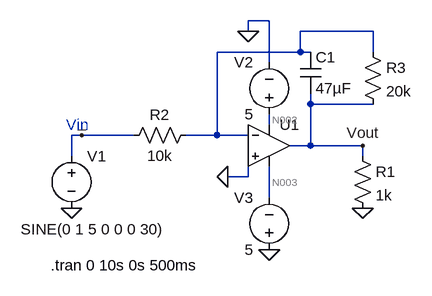
[diagram p0: schematic Draft3.asc]
Draft3.asc, the LTspice schematic file:
Version 4
SHEET 1 880 680
WIRE 144 16 112 16
WIRE 112 32 112 16
WIRE 304 32 192 32
WIRE 192 64 192 32
WIRE 192 64 64 64
WIRE 208 64 192 64
WIRE 304 64 304 32
WIRE 144 80 144 16
WIRE 208 144 208 128
WIRE 304 144 208 144
WIRE 144 176 144 160
WIRE -144 192 -160 192
WIRE -64 192 -144 192
WIRE 64 192 64 64
WIRE 64 192 16 192
WIRE 112 192 64 192
WIRE 208 208 208 144
WIRE 208 208 176 208
WIRE 288 208 208 208
WIRE -160 224 -160 192
WIRE 288 224 288 208
WIRE 112 256 112 224
WIRE 112 256 80 256
WIRE 144 288 144 240
FLAG 288 304 0
FLAG 80 256 0
FLAG 144 368 0
FLAG 112 32 0
FLAG -160 304 0
FLAG -144 192 _
FLAG 288 208 Vout
SYMBOL cap 192 64 R0
SYMATTR InstName C1
SYMATTR Value 47µF
SYMBOL Opamps\\UniversalOpamp2 144 208 R0
SYMATTR InstName U1
SYMBOL res 272 208 R0
SYMATTR InstName R1
SYMATTR Value 1k
SYMBOL res -80 208 R270
WINDOW 0 32 56 VTop 2
WINDOW 3 0 56 VBottom 2
SYMATTR InstName R2
SYMATTR Value 10k
SYMBOL voltage -160 208 R0
WINDOW 3 -78 129 Left 2
WINDOW 123 0 0 Left 0
WINDOW 39 0 0 Left 0
SYMATTR Value SINE(0 1 5 0 0 0 30)
SYMATTR InstName V1
SYMBOL voltage 144 176 R180
WINDOW 0 24 96 Left 2
WINDOW 3 24 16 Left 2
WINDOW 123 0 0 Left 0
WINDOW 39 0 0 Left 0
SYMATTR InstName V2
SYMATTR Value 5
SYMBOL voltage 144 384 R180
WINDOW 0 24 96 Left 2
WINDOW 3 24 16 Left 2
WINDOW 123 0 0 Left 0
WINDOW 39 0 0 Left 0
SYMATTR InstName V3
SYMATTR Value 5
SYMBOL res 288 48 R0
SYMATTR InstName R3
SYMATTR Value 20k
TEXT -192 392 Left 2 !.tran 0 10s 0s 500ms
TEXT -168 176 Left 2 ;Vin

The netlist it stands for:
* Draft3.asc
C1 N001 Vout 47µF
XU1 0 N001 N002 N003 Vout level.2 Avol=1Meg GBW=10Meg Slew=10Meg ilimit=25m rail=0 Vos=0 phimargin=45 en=0 enk=0 in=0 ink=0 Rin=500Meg  ; pins IN+ IN- V+ V- OUT
R1 Vout 0 1k
R2 _ N001 10k
V1 _ 0 SINE(0 1 5 0 0 0 30)
V2 N002 0 5
V3 0 N003 5
R3 N001 Vout 20k
.tran 0 10s 0s 500ms
* Vin
.lib UniversalOpamps2.sub
.backanno
.end

* Results of the author's LTspice run, read from the files saved beside the schematic
* Operating Point, zero values left out:
*   V(n002) = 5 V
*   V(n003) = -5 V
*   I(V3) = -500 µA
*   I(V2) = -500 µA
*   Ix(u1:3) = 500 µA
*   Ix(u1:4) = -500 µA
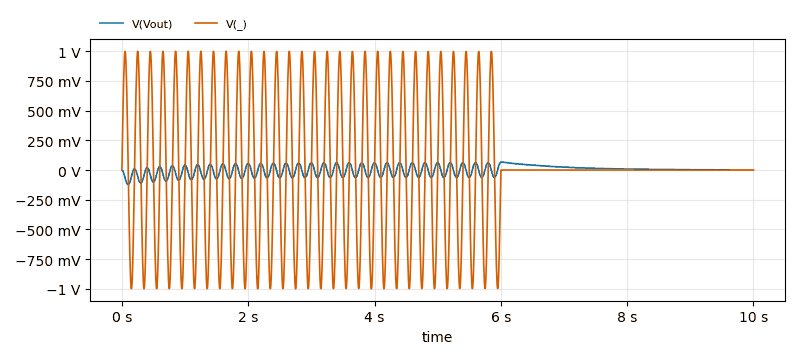
[diagram p1: Transient Analysis of Draft3.asc, plotted from the saved traces]
* Transient Analysis, 1 run:
*   V(Vout): min -121.4 mV, max 67.04 mV, average 486.5 µV, rms 40.48 mV, last 918.1 µV
*   V(_): min -1 V, max 1 V, average -172.2 µV, rms 553.7 mV, last 0 V